# EAGLE design Crutch_light_Switch (EAGLE 9.6.2)
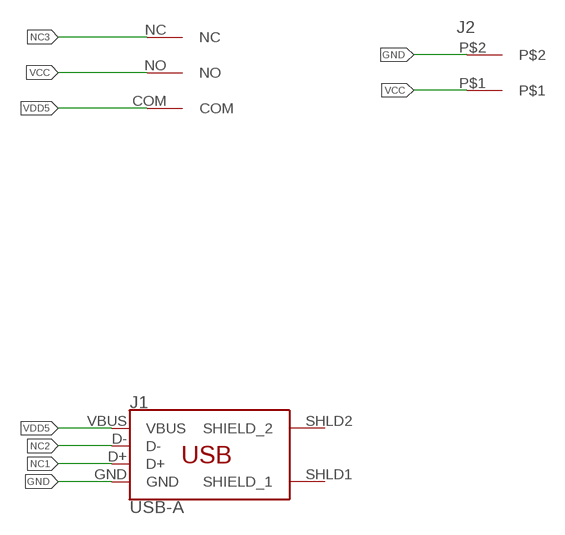
[diagram p0: schematic, sheet 1]

## Parts
J1  USB-A  USB_A  [USB_A_SMT]
J2  2-pos  3.81MM_1_X_2_RT_ANGLE_PLUG_HEADER  [2_3.81MM_PITCH]
U$1  LIMIT_SWITCH_D2HW-BR201DR  [LIMIT_SWITCH_D2HW-BR201DR]

## Nets
GND: J1.GND J2.P$2
NC1: J1.D+
NC2: J1.D-
NC3: U$1.NC
VCC: J2.P$1 U$1.NO
VDD5: J1.VBUS U$1.COM
Unconnected: J1.SHLD1(SHIELD_1) J1.SHLD2(SHIELD_2)

## Library data of the parts
J1 = 3D_MIG_Controller:USB_A: USB-A Connector Male and female variants, as well as PTH and SMT variants SparkFun Products: SparkFun XBee Explorer Dongle <https://www.sparkfun.com/products/11697> PTH Male SparkFun MicroView-USB Programmer <https://www.sparkfun.com/products/12924> SMT Male SparkFun USB Type A Female Breakout <https://www.sparkfun.com/products/12700> SMT Female; PARTNO: 87583-3010RPALF
J2 = 3D_MIG_Controller:3.81MM_1_X_2_RT_ANGLE_PLUG_HEADER: TERM BLOCK HDR 2POS 90DEG 3.81MM; PARTNO: 691322310002
U$1 = 3D_MIG_Controller:LIMIT_SWITCH_D2HW-BR201DR

## Board
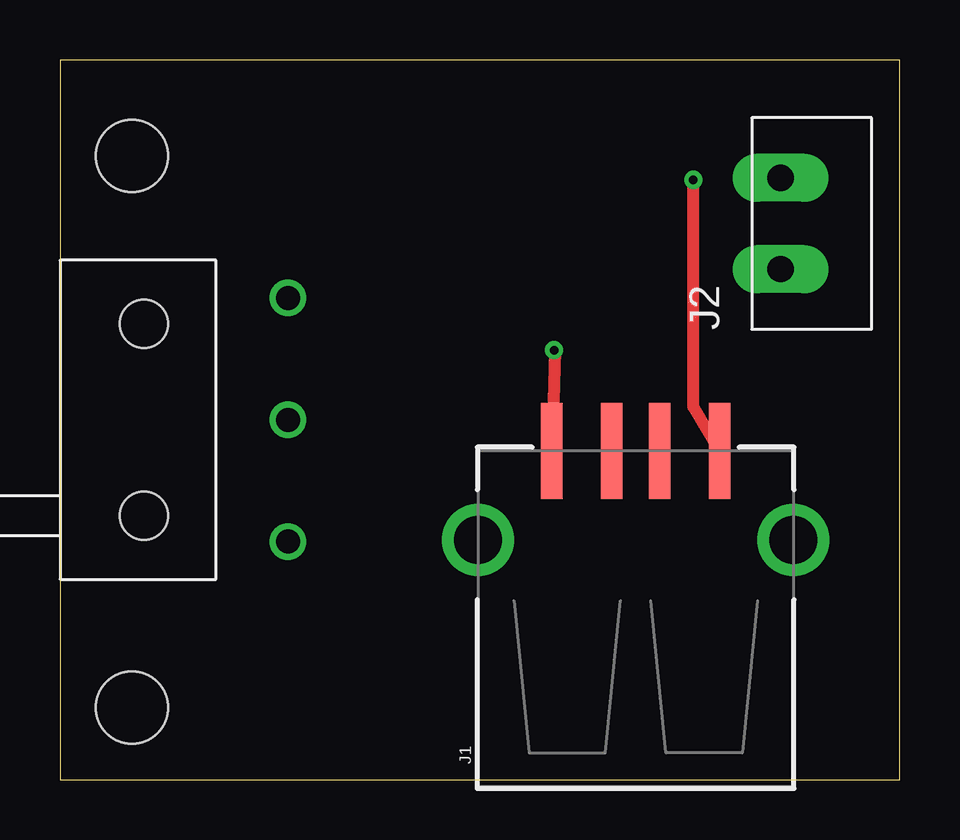
[diagram p1: board, top side]
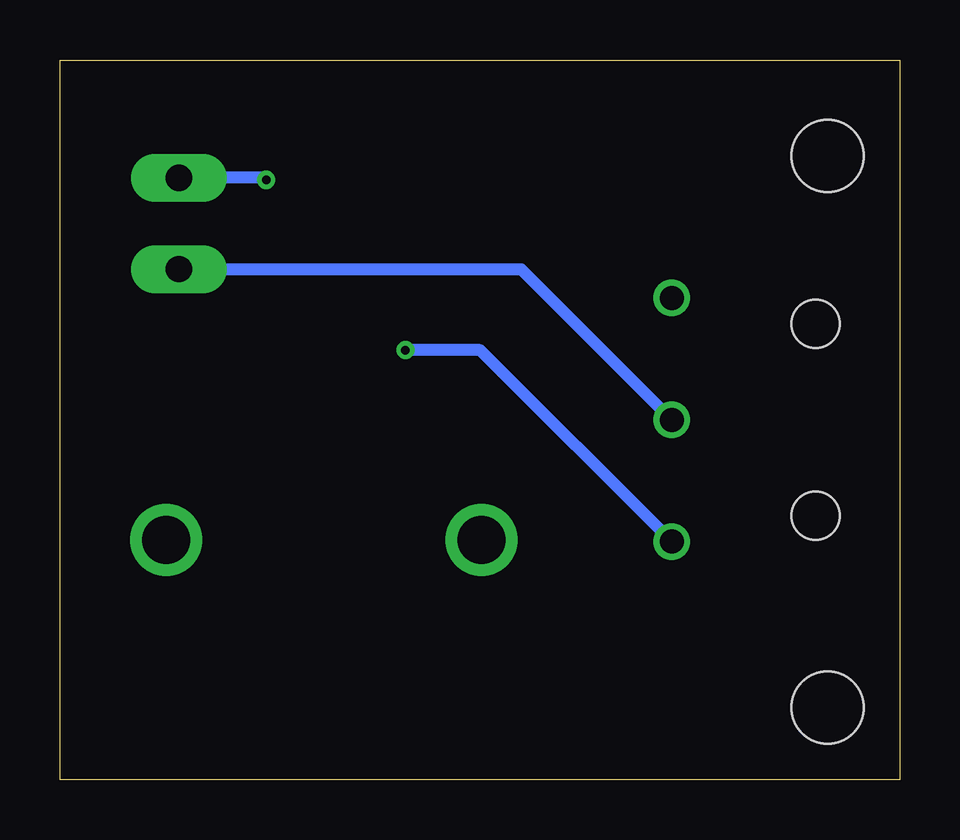
[diagram p2: board, bottom side, seen from below]

Size 35 x 30 mm. Coordinates in mm from the lower left corner, seen from the top.
Outline: 0,0 35,0 35,30 0,30 0,0
Copper layers (1*16): Top 0.035mm / dielectric 1.5mm / Bottom 0.035mm
Design rules "default": minimum track width 6mil, minimum drill 0.35mm, track to track 6mil, track to pad 6mil, pad to pad 6mil, via to via 6mil, smd to smd 6mil, copper to edge 40mil, drill to drill 6mil, minimum pad ring 10mil, minimum via ring 8mil, stop-mask expansion 4mil, vias tented up to drill 0mil, thermal gap 10mil
Holes 3 mm at 3,3 3,26

### Footprints (pad centres in the part's own frame; a part is rotated, then mirrored left to right if it is on the bottom)
USB_A_SMT = smd 4 x 0.9: D+ 6.7,-1; D- 6.7,1; GND 6.7,-3.5; VBUS 6.7,3.5 | drill 2: SHLD1 3,-6.566; SHLD2 3,6.566
2_3.81MM_PITCH = drill 1.1 pad 2 long: P$1 0,0; P$2 3.81,0
LIMIT_SWITCH_D2HW-BR201DR = drill 1: COM 3,-5.08; NC 3,5.08; NO 3,0 | hole 1.999: -3,-4; -3,4

### Placement (x,y rotation side)
J1  24,7 90 top
J2  30.04,21.28 90 top
U$1  6.5,15 0 top

### Tracks (layer width: path | path; a pad name or v marks a point on that pad's centre or on a via)
GND  (via drill 0.35)
  Top 0.508: J1.GND 26.4,15.55 v26.4,25
  Bottom 0.508: v26.4,25 26.49,25.09 J2.P$2
VCC
  Bottom 0.508: J2.P$1 15.78,21.28 U$1.NO
VDD5  (via drill 0.35)
  Top 0.508: v20.6,17.9 20.63,17.87 J1.VBUS
  Bottom 0.508: U$1.COM 17.48,17.9 v20.6,17.9